# Altium schematic sheet Transceiver.SchDoc
size A4
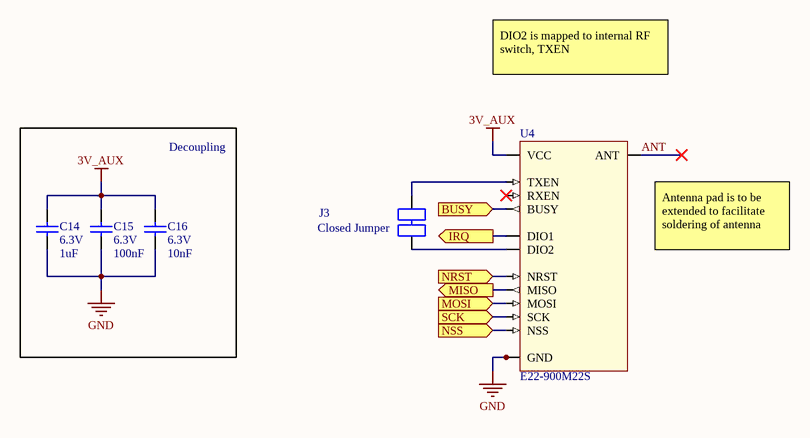
[diagram p0: Transceiver.SchDoc]

## Parts
C14  value 1uF  Voltage: 6.3V  [0603 (1608M)]  (hidden comment: Cap)
C15  value 100nF  Voltage: 6.3V  [0603 (1608M)]  (hidden comment: Cap)
C16  value 10nF  Voltage: 6.3V  [0603 (1608M)]  (hidden comment: Cap)
J3  Closed Jumper  [Jumper (Close)]  (net tie, no BOM)
U4  E22-900M22S  [E22-900M22S]

## Blocks framed on the sheet
Decoupling: C14-C16

## Ports
BUSY (in), IRQ (out), MISO (out), MOSI (in), NRST (in), NSS (in), SCK (in)

## Nets
3V_AUX: C14.2 C15.2 C16.2 U4.9(VCC)
GND: C14.1 C15.1 C16.1 U4.1(GND) U4.2(GND) U4.3(GND) U4.4(GND) U4.5(GND) U4.10(GND) U4.11(GND) U4.12(GND) U4.20(GND) U4.22(GND)
ANT: U4.21(ANT)
BUSY: U4.14(BUSY) ; port BUSY
IRQ: U4.13(DIO1) ; port IRQ
MISO: U4.16(MISO) ; port MISO
MOSI: U4.17(MOSI) ; port MOSI
NRST: U4.15(NRST) ; port NRST
NSS: U4.19(NSS) ; port NSS
SCK: U4.18(SCK) ; port SCK
NetJ3_1: J3.1 U4.8(DIO2)
NetJ3_2: J3.2 U4.7(TXEN)

Not connected (* = marked no-connect by the designer): U4 6(RXEN)*

## Notes on the sheet
- DIO2 is mapped to internal RF switch, TXEN
- (near U4) Antenna pad is to be extended to facilitate soldering of antenna

## Library data of the parts
C14-C16 = Cap: Capacitor
J3 = Jumper (Closed)
U4 = E22-900M22S: SX1262-based Wireless Module; ComponentLink1Description: Product Page; ComponentLink1URL: http://www.ebyte.com/en/product-view-news.aspx?id=437